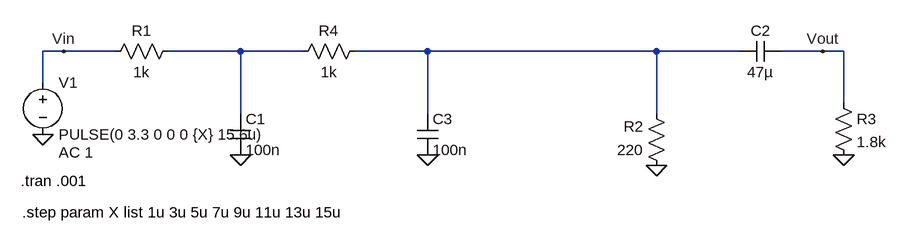
[diagram p0: schematic PWM-Reconstruction-Filter.asc]
PWM-Reconstruction-Filter.asc, the LTspice schematic file:
Version 4
SHEET 1 1080 680
WIRE -368 80 -400 80
WIRE -288 80 -368 80
WIRE -96 80 -208 80
WIRE 0 80 -96 80
WIRE 192 80 80 80
WIRE 544 80 192 80
WIRE 672 80 544 80
WIRE 800 80 736 80
WIRE 832 80 800 80
WIRE -400 128 -400 80
WIRE 832 160 832 80
WIRE -96 176 -96 80
WIRE 192 176 192 80
WIRE 544 176 544 80
FLAG -400 208 0
FLAG -96 240 0
FLAG 544 256 0
FLAG 832 240 0
FLAG 800 80 Vout
FLAG -368 80 Vin
FLAG 192 240 0
SYMBOL voltage -400 112 R0
WINDOW 123 24 124 Left 2
WINDOW 39 0 0 Left 0
SYMATTR InstName V1
SYMATTR Value PULSE(0 3.3 0 0 0 {X} 15.6u)
SYMATTR Value2 AC 1
SYMBOL res -192 64 R90
WINDOW 0 0 56 VBottom 2
WINDOW 3 32 56 VTop 2
SYMATTR InstName R1
SYMATTR Value 1k
SYMBOL res 560 272 R180
WINDOW 0 36 76 Left 2
WINDOW 3 36 40 Left 2
SYMATTR InstName R2
SYMATTR Value 220
SYMBOL cap -112 176 R0
SYMATTR InstName C1
SYMATTR Value 100n
SYMBOL res 816 144 R0
SYMATTR InstName R3
SYMATTR Value 1.8k
SYMBOL cap 736 64 R90
WINDOW 0 0 32 VBottom 2
WINDOW 3 32 32 VTop 2
SYMATTR InstName C2
SYMATTR Value 47µ
SYMBOL cap 176 176 R0
SYMATTR InstName C3
SYMATTR Value 100n
SYMBOL res 96 64 R90
WINDOW 0 0 56 VBottom 2
WINDOW 3 32 56 VTop 2
SYMATTR InstName R4
SYMATTR Value 1k
TEXT -434 280 Left 2 !.tran .001
TEXT -432 328 Left 2 !.step param X list 1u 3u 5u 7u 9u 11u 13u 15u

The netlist it stands for:
* PWM-Reconstruction-Filter.asc
V1 Vin 0 PULSE(0 3.3 0 0 0 {X} 15.6u) AC 1
R1 N001 Vin 1k
R2 0 N002 220
C1 N001 0 100n
R3 Vout 0 1.8k
C2 Vout N002 47µ
C3 N002 0 100n
R4 N002 N001 1k
.tran .001
.step param X list 1u 3u 5u 7u 9u 11u 13u 15u
.backanno
.end